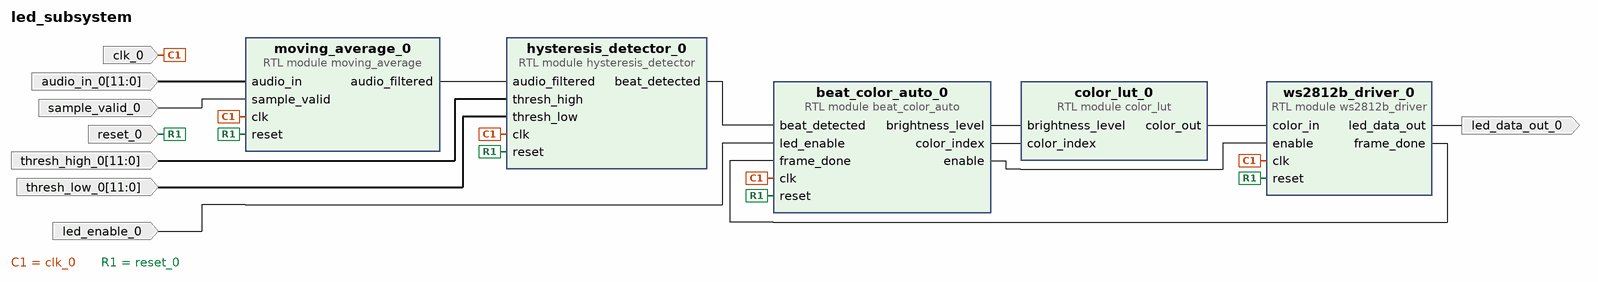
[diagram p0: block diagram of the top level]
# Vivado block design led_subsystem, xc7a35tcpg236-1, Vivado 2025.2
create_bd_design led_subsystem

create_bd_port -dir I -type clk clk_0
create_bd_port -dir O led_data_out_0
create_bd_port -dir I -type rst reset_0
create_bd_port -dir I led_enable_0
create_bd_port -dir I -from 11 -to 0 audio_in_0
create_bd_port -dir I sample_valid_0
create_bd_port -dir I -from 11 -to 0 thresh_high_0
create_bd_port -dir I -from 11 -to 0 thresh_low_0

create_bd_cell -type module -reference ws2812b_driver ws2812b_driver_0
create_bd_cell -type module -reference color_lut color_lut_0
create_bd_cell -type module -reference moving_average moving_average_0
create_bd_cell -type module -reference hysteresis_detector hysteresis_detector_0
create_bd_cell -type module -reference beat_color_auto beat_color_auto_0

# ---- connections ----

connect_bd_net -net audio_in_0_1 [get_bd_ports audio_in_0] [get_bd_pins moving_average_0/audio_in]
connect_bd_net [get_bd_pins beat_color_auto_0/brightness_level] [get_bd_pins color_lut_0/brightness_level]
connect_bd_net [get_bd_pins beat_color_auto_0/color_index] [get_bd_pins color_lut_0/color_index]
connect_bd_net [get_bd_pins beat_color_auto_0/enable] [get_bd_pins ws2812b_driver_0/enable]
connect_bd_net -net clk_0_1 [get_bd_ports clk_0] \
  [get_bd_pins ws2812b_driver_0/clk] [get_bd_pins hysteresis_detector_0/clk] [get_bd_pins moving_average_0/clk] \
  [get_bd_pins beat_color_auto_0/clk]
connect_bd_net [get_bd_pins color_lut_0/color_out] [get_bd_pins ws2812b_driver_0/color_in]
connect_bd_net [get_bd_pins hysteresis_detector_0/beat_detected] [get_bd_pins beat_color_auto_0/beat_detected]
connect_bd_net -net led_enable_0_1 [get_bd_ports led_enable_0] [get_bd_pins beat_color_auto_0/led_enable]
connect_bd_net [get_bd_pins moving_average_0/audio_filtered] [get_bd_pins hysteresis_detector_0/audio_filtered]
connect_bd_net -net reset_0_1 [get_bd_ports reset_0] \
  [get_bd_pins ws2812b_driver_0/reset] [get_bd_pins hysteresis_detector_0/reset] [get_bd_pins moving_average_0/reset] \
  [get_bd_pins beat_color_auto_0/reset]
connect_bd_net -net sample_valid_0_1 [get_bd_ports sample_valid_0] [get_bd_pins moving_average_0/sample_valid]
connect_bd_net -net thresh_high_0_1 [get_bd_ports thresh_high_0] [get_bd_pins hysteresis_detector_0/thresh_high]
connect_bd_net -net thresh_low_0_1 [get_bd_ports thresh_low_0] [get_bd_pins hysteresis_detector_0/thresh_low]
connect_bd_net [get_bd_pins ws2812b_driver_0/frame_done] [get_bd_pins beat_color_auto_0/frame_done]
connect_bd_net [get_bd_pins ws2812b_driver_0/led_data_out] [get_bd_ports led_data_out_0]

validate_bd_design
save_bd_design
